# EAGLE design SolarMonitor (EAGLE 6.5.0)
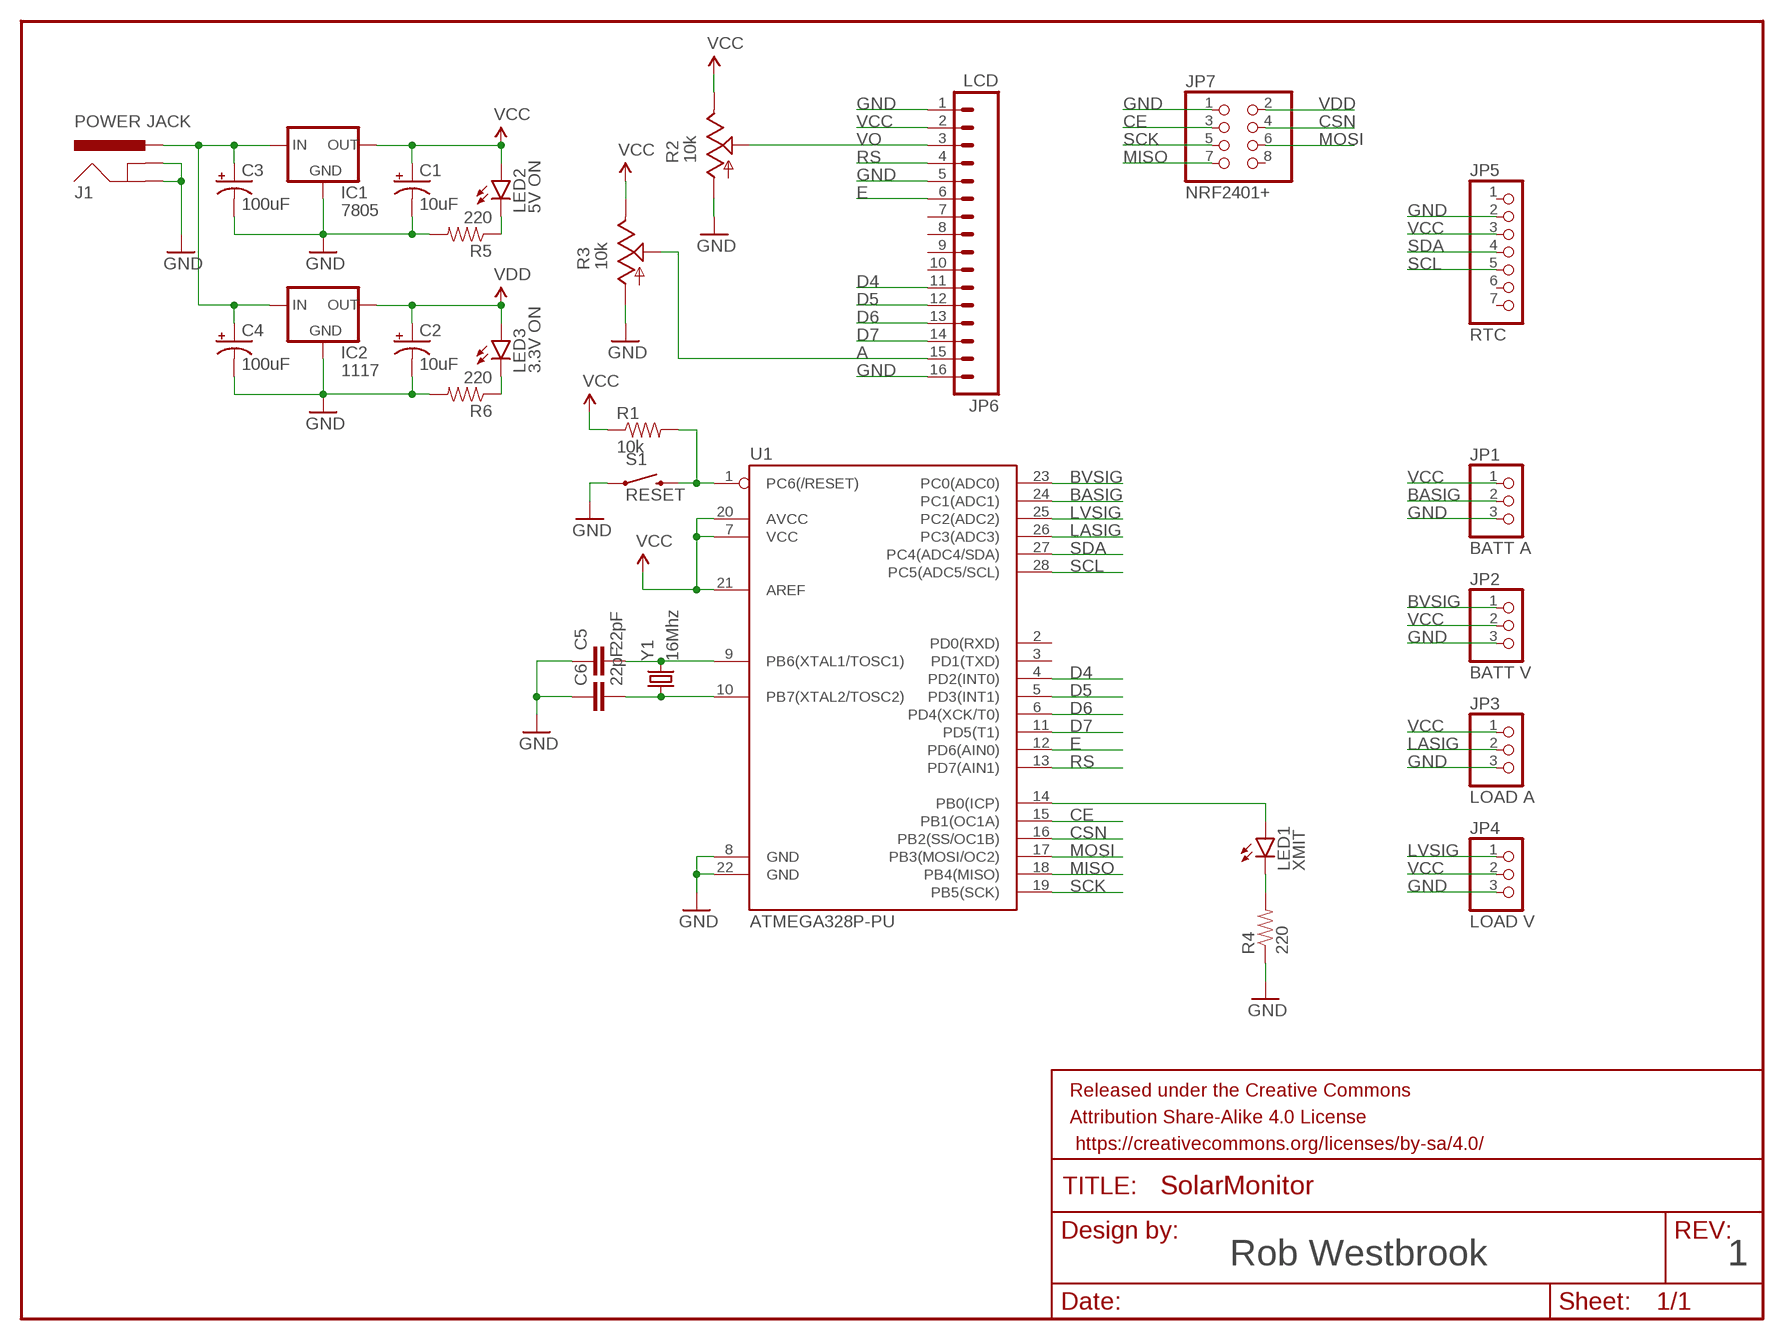
[diagram p0: schematic, sheet 1]

## Parts
C1  10uF  CAP_POLPTH1  [CPOL-RADIAL-100UF-25V]
C2  10uF  CAP_POLPTH1  [CPOL-RADIAL-100UF-25V]
C3  100uF  CAP_POLPTH2  [CPOL-RADIAL-10UF-25V]
C4  100uF  CAP_POLPTH2  [CPOL-RADIAL-10UF-25V]
C5  22pF  CAPEZ  [CAP-PTH-SMALLEZ]
C6  22pF  CAPEZ  [CAP-PTH-SMALLEZ]
FRAME1  FRAME-LETTER  [CREATIVE_COMMONS]
IC1  7805  V_REG_78XX-TO-220  [TO-220-ALT]
IC2  1117  V_REG_LD1117VXX  [78XXL]
J1  POWER JACK  POWER_JACKPTH  [POWER_JACK_PTH]
JP1  BATT A  PINHD-1X3  [1X03]
JP2  BATT V  PINHD-1X3  [1X03]
JP3  LOAD A  PINHD-1X3  [1X03]
JP4  LOAD V  PINHD-1X3  [1X03]
JP5  RTC  PINHD-1X7  [1X07]
JP6  LCD  M16LOCK  [1X16_LOCK]
JP7  NRF2401+  PINHD-2X4  [2X04]
LED1  XMIT  LED5MM  [LED5MM]
LED2  5V ON  LED5MM  [LED5MM]
LED3  3.3V ON  LED5MM  [LED5MM]
R1  10k  RESISTORPTH-1/4W  [AXIAL-0.4]
R2  10k  TRIM_US-S64W  [S64W]
R3  10k  TRIM_US-S64W  [S64W]
R4  220  RESISTORPTH-1/4W  [AXIAL-0.4]
R5  220  RESISTORPTH-1/4W  [AXIAL-0.4]
R6  220  RESISTORPTH-1/4W  [AXIAL-0.4]
S1  RESET  SWITCH-MOMENTARY-2PTH  [TACTILE-PTH]
U1  ATMEGA328P-PU  ATMEGA328P_PDIP  [DIL28-3]
Y1  16Mhz  CRYSTALHC49US  [HC49US]

## Nets
A: JP6.15 R3.S
BASIG: JP1.2 U1.24(PC1(ADC1))
BVSIG: JP2.1 U1.23(PC0(ADC0))
CE: JP7.3 U1.15(PB1(OC1A))
CSN: JP7.4 U1.16(PB2(SS/OC1B))
D4: JP6.11 U1.4(PD2(INT0))
D5: JP6.12 U1.5(PD3(INT1))
D6: JP6.13 U1.6(PD4(XCK/T0))
D7: JP6.14 U1.11(PD5(T1))
E: JP6.6 U1.12(PD6(AIN0))
GND: C1.2(-) C2.2(-) C3.2(-) C4.2(-) C5.1 C6.1 IC1.GND IC2.IN(GND) J1.GND J1.GNDBREAK JP1.3 JP2.3 JP3.3 JP4.3 JP5.2 JP6.1 JP6.5 JP6.16 JP7.1 R2.A R3.A R4.P$1 R5.P$2 R6.P$2 S1.1 U1.8(GND) U1.22(GND)
LASIG: JP3.2 U1.26(PC3(ADC3))
LVSIG: JP4.1 U1.25(PC2(ADC2))
MISO: JP7.7 U1.18(PB4(MISO))
MOSI: JP7.6 U1.17(PB3(MOSI/OC2))
N$1: C3.1(+) C4.1(+) IC1.IN IC2.OUT(IN) J1.PWR
N$2: C5.2 U1.9(PB6(XTAL1/TOSC1)) Y1.2
N$3: C6.2 U1.10(PB7(XTAL2/TOSC2)) Y1.1
N$4: LED1.A U1.14(PB0(ICP))
N$5: LED1.K(C) R4.P$2
N$6: R1.P$2 S1.3 U1.1(PC6(/RESET))
N$7: LED3.K(C) R6.P$1
N$8: LED2.K(C) R5.P$1
RS: JP6.4 U1.13(PD7(AIN1))
SCK: JP7.5 U1.19(PB5(SCK))
SCL: JP5.5 U1.28(PC5(ADC5/SCL))
SDA: JP5.4 U1.27(PC4(ADC4/SDA))
VCC: C1.1(+) IC1.OUT JP1.1 JP2.2 JP3.1 JP4.2 JP5.3 JP6.2 LED2.A R1.P$1 R2.E R3.E U1.7(VCC) U1.20(AVCC) U1.21(AREF)
VDD: C2.1(+) IC2.GND(OUT) JP7.2 LED3.A
VO: JP6.3 R2.S
Unconnected: JP5.1 JP5.6 JP5.7 JP6.7 JP6.8 JP6.9 JP6.10 JP7.8 U1.2(PD0(RXD)) U1.3(PD1(TXD))

## Notes on the sheet
- Rob Westbrook | 1

## Library data of the parts
C1-C4 = SparkFun-Capacitors:CAP_POL: Capacitor Polarized These are standard SMD and PTH capacitors. Normally 10uF, 47uF, and 100uF in electrolytic and tantalum varieties. Always verify the external diameter of the through hole cap, it varies with capacity, voltage, and manufacturer. The EIA devices should be standard.
C5 C6 = SparkFun-Capacitors:CAP: Capacitor Standard 0603 ceramic capacitor, and 0.1" leaded capacitor.
FRAME1 = SparkFun-Aesthetics:FRAME-LETTER: Schematic Frame Standard 8.5x11 US Letter frame
IC1 = SparkFun-PowerIC:V_REG_78XX: Voltage Regulator Standard 7805 5V regulator. IGO (Input Ground Output). Spark Fun Electronics SKU : COM-00107
IC2 = SparkFun-PowerIC:V_REG_LD1117VXX: LD1117VXX voltage regulator. We carry the 3.3V version (COM-00526) in TO-220 package.
J1 = SparkFun-Connectors:POWER_JACK: Power Jack This is the standard 5.5mm barrel jack for power. The PTH is the most common, proven, reliable, footprint. The Slot footprint only works if the mill layer is transmitted to the PCB fab house so be warned. Mating wall wart : TOL-00298 (and others); PROD_ID: PRT-00119
JP1-JP4 = pinhead:PINHD-1X3: PIN HEADER
JP5 = pinhead:PINHD-1X7: PIN HEADER
JP6 = SparkFun-Connectors:M16: 1x16 .1" header
JP7 = pinhead:PINHD-2X4: PIN HEADER
LED1-LED3 = SparkFun-LED:LED: LEDs Standard schematic elements and footprints for 5mm, 3mm, 1206, and 0603 sized LEDs. 5mm - Spark Fun Electronics SKU : COM-00529 (and others)
R1 R4-R6 = SparkFun-Passives:RESISTOR: Resistor Basic schematic elements and footprints for 0603, 1206, and PTH resistors.
R2 R3 = pot:TRIM_US-: POTENTIOMETER
S1 = SparkFun-Electromechanical:SWITCH-MOMENTARY-2: Various NO switches- pushbuttons, reed, etc
U1 = SparkFun-DigitalIC:ATMEGA328P_PDIP: uC used in the Arduino 32kb flash, 1k EEPROM, 2k SRAM This is the through-hole version of this chip.
Y1 = SparkFun-FreqCtrl:CRYSTAL: Various standard crystals. Proven footprints. Spark Fun Electronics SKU : COM-00534

## Net classes
0 default: clearance 0.205 mm

## Board
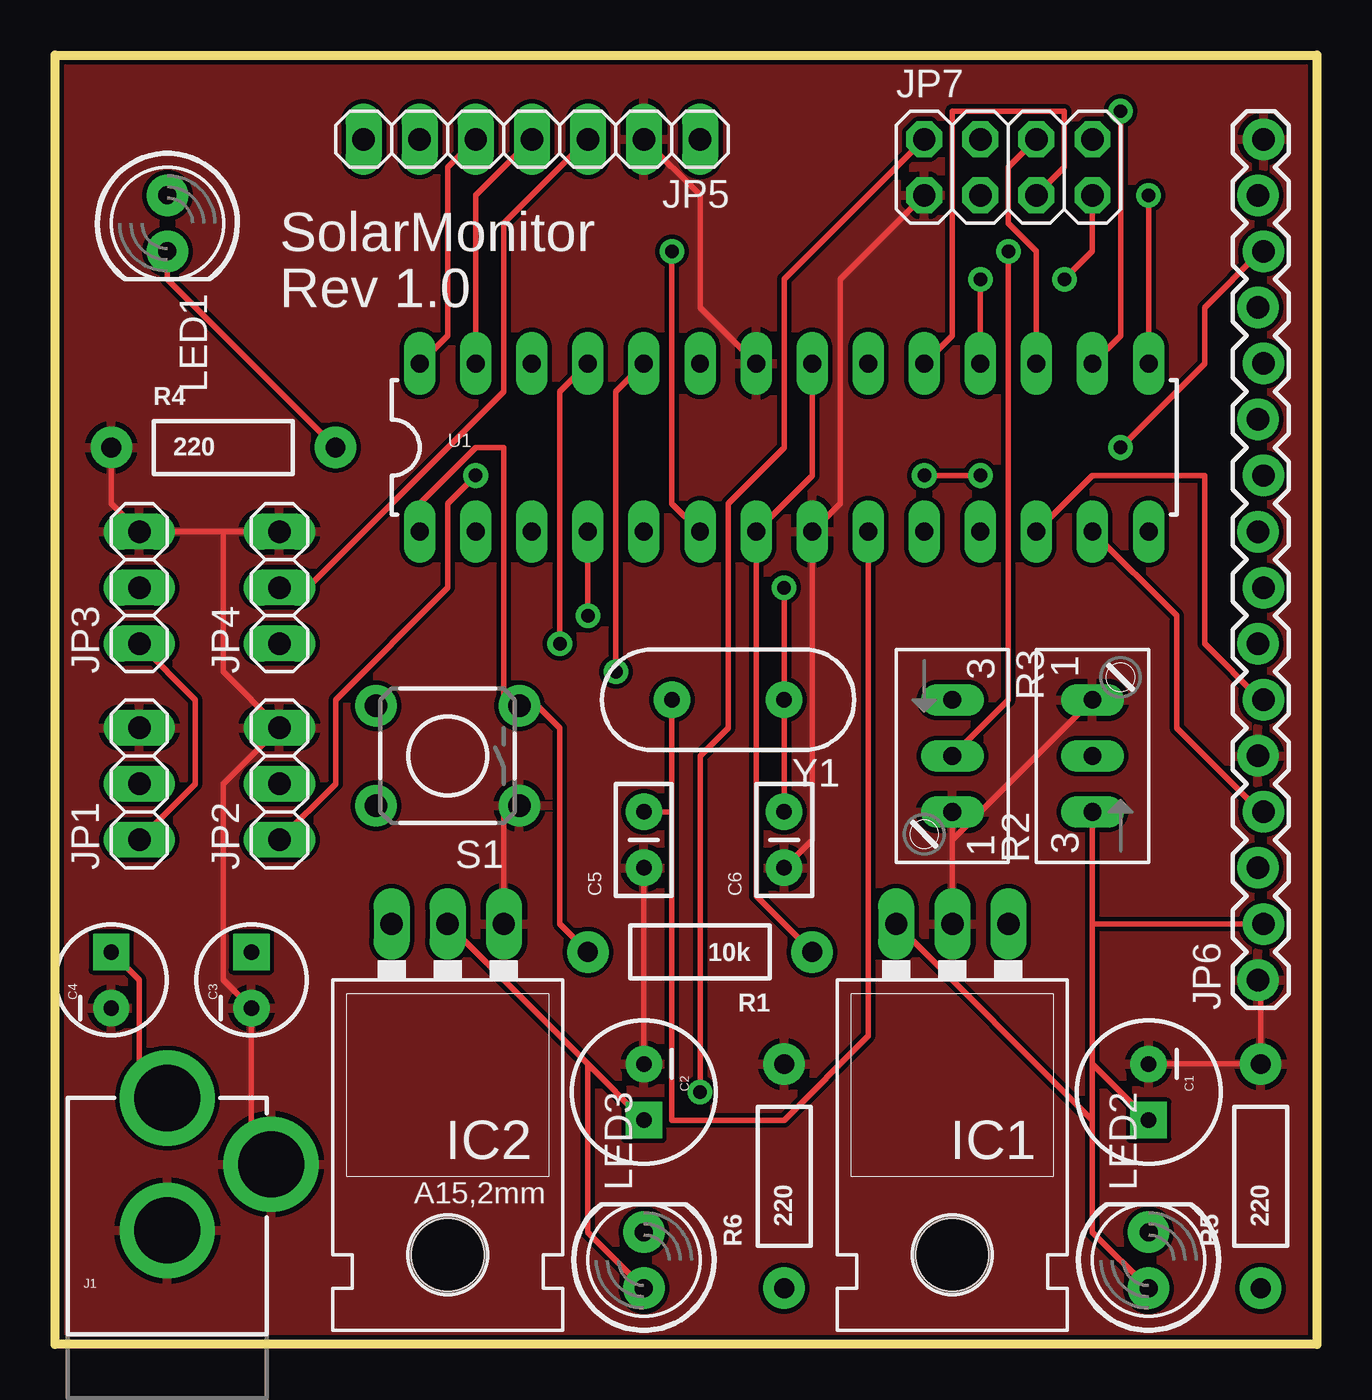
[diagram p1: board, top side]
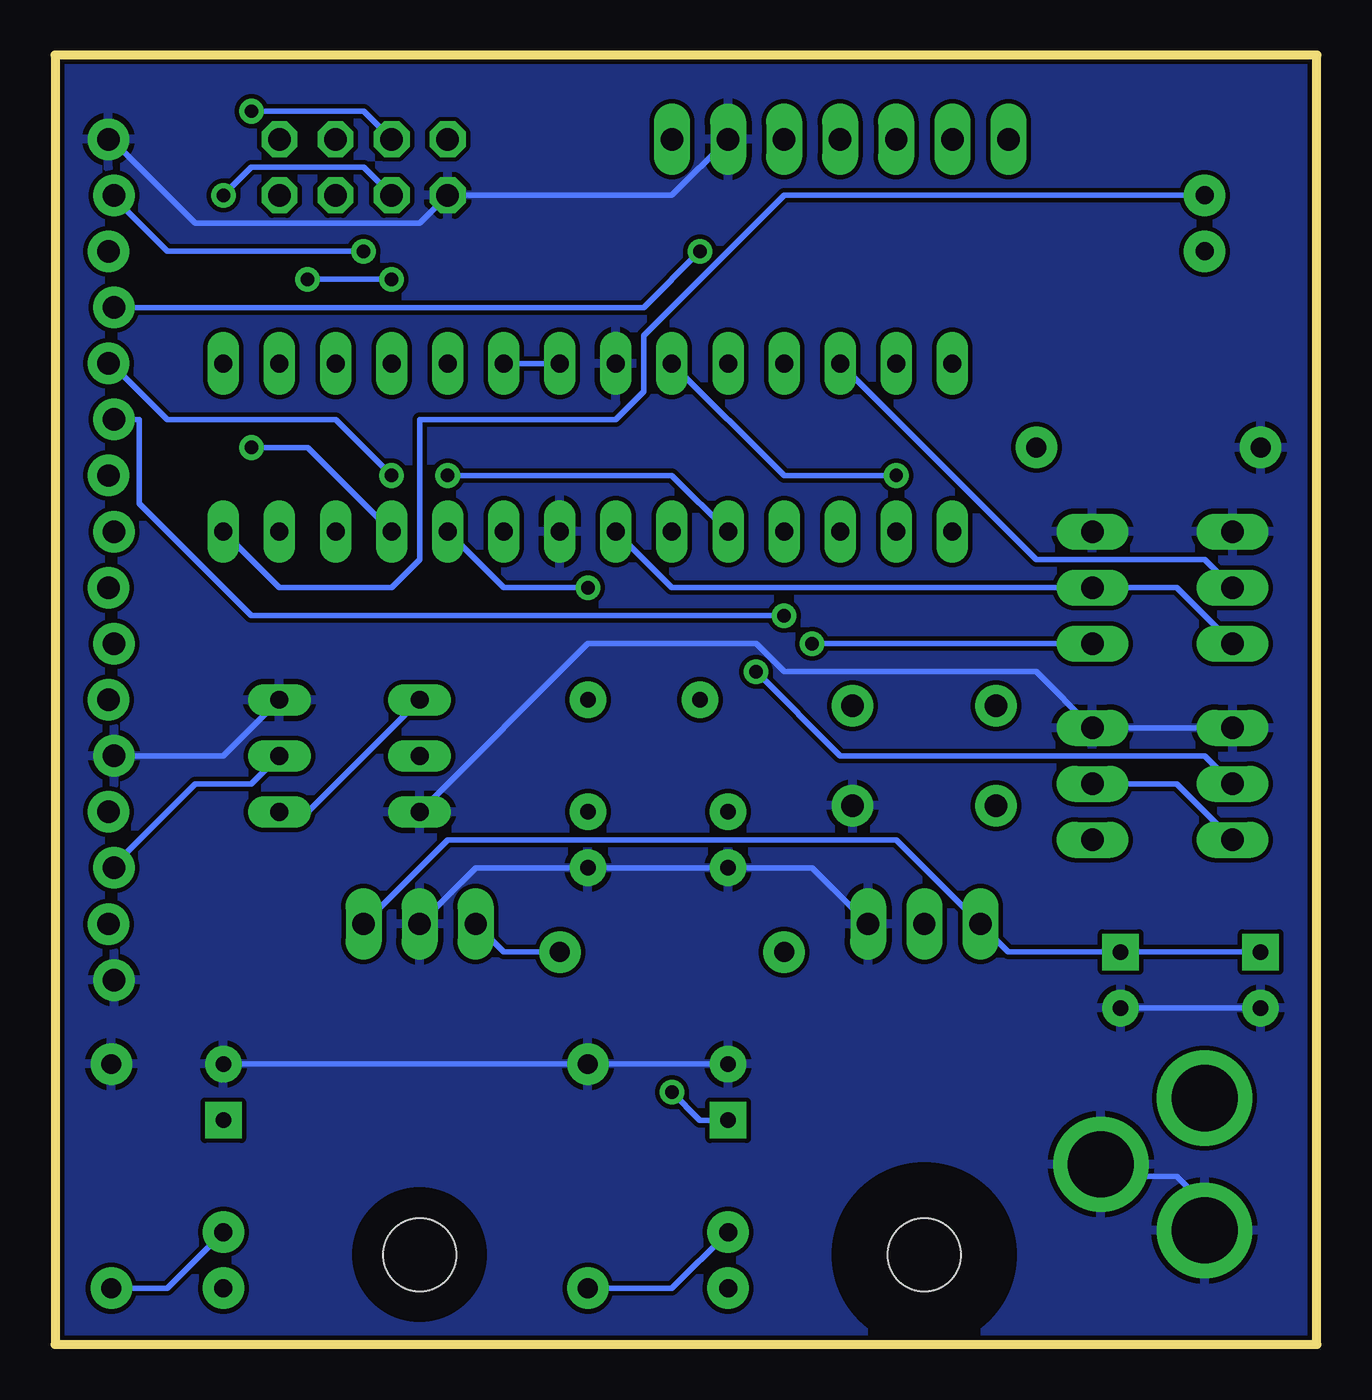
[diagram p2: board, bottom side, seen from below]

Size 57.15 x 58.42 mm. Coordinates in mm from the lower left corner, seen from the top.
Outline: 0,0 0,58.42 57.15,58.42 57.15,0 0,0
Copper layers (1*16): Top 0.035mm / dielectric 1.5mm / Bottom 0.035mm
Design rules "SparkFun": minimum track width 8mil, minimum drill 20mil, track to track 8mil, track to pad 8mil, pad to pad 8mil, via to via 8mil, smd to smd 8mil, copper to edge 8mil, drill to drill 8mil, minimum pad ring 12mil, minimum via ring 10mil, stop-mask expansion 4mil, vias tented up to drill 20mil, thermal gap 10mil

### Footprints (pad centres in the part's own frame; a part is rotated, then mirrored left to right if it is on the bottom)
CPOL-RADIAL-100UF-25V = drill 0.7 pad 1.651 square: 1 1.27,0 | drill 0.7 pad 1.651: 2 -1.27,0
CPOL-RADIAL-10UF-25V = drill 0.7 pad 1.651 square: 1 1.27,0 | drill 0.7 pad 1.651: 2 -1.27,0
CAP-PTH-SMALLEZ = drill 0.7 pad 1.651: 1 0,0; 2 2.54,0
TO-220-ALT = drill 1.016 long: GND 0,-3.81; IN -2.54,-3.81; OUT 2.54,-3.81 | hole 3.302: 0,11.176
78XXL = drill 1.016 long: GND 0,-3.81; IN -2.54,-3.81; OUT 2.54,-3.81 | hole 3.302: 0,11.176
POWER_JACK_PTH = drill 2.997 pad 4.318: GND 0,7.7; GNDBREAK 4.7,10.7; PWR 0,13.7
1X03 = drill 1.016 long: 1 -2.54,0; 2 0,0; 3 2.54,0
1X07 = drill 1.016 long: 1 -7.62,0; 2 -5.08,0; 3 -2.54,0; 4 0,0; 5 2.54,0; 6 5.08,0; 7 7.62,0
1X16_LOCK = drill 1.016 pad 1.88: 1 0,0.127; 2 2.54,-0.127; 3 5.08,0.127; 4 7.62,-0.127; 5 10.16,0.127; 6 12.7,-0.127; 7 15.24,0.127; 8 17.78,-0.127; 9 20.32,0.127; 10 22.86,-0.127; 11 25.4,0.127; 12 27.94,-0.127; 13 30.48,0.127; 14 33.02,-0.127; 15 35.56,0.127; 16 38.1,-0.127
2X04 = drill 1.016 octagon: 1 -3.81,-1.27; 2 -3.81,1.27; 3 -1.27,-1.27; 4 -1.27,1.27; 5 1.27,-1.27; 6 1.27,1.27; 7 3.81,-1.27; 8 3.81,1.27
LED5MM = drill 0.813 pad 1.88: A -1.27,0; K 1.27,0
AXIAL-0.4 = drill 0.9 pad 1.88: P$1 -5.08,0; P$2 5.08,0
S64W = drill 0.813 long: A 2.54,1.27; E -2.54,1.27; S 0,1.27
TACTILE-PTH = drill 1.016 pad 1.88: 1 -3.251,2.261; 2 3.251,2.261; 3 -3.251,-2.261; 4 3.251,-2.261
DIL28-3 = drill 0.813 long: 1 -16.51,-3.81; 2 -13.97,-3.81; 3 -11.43,-3.81; 4 -8.89,-3.81; 5 -6.35,-3.81; 6 -3.81,-3.81; 7 -1.27,-3.81; 8 1.27,-3.81; 9 3.81,-3.81; 10 6.35,-3.81; 11 8.89,-3.81; 12 11.43,-3.81; 13 13.97,-3.81; 14 16.51,-3.81; 15 16.51,3.81; 16 13.97,3.81; 17 11.43,3.81; 18 8.89,3.81; 19 6.35,3.81; 20 3.81,3.81; 21 1.27,3.81; 22 -1.27,3.81; 23 -3.81,3.81; 24 -6.35,3.81; 25 -8.89,3.81; 26 -11.43,3.81; 27 -13.97,3.81; 28 -16.51,3.81
HC49US = drill 0.7 pad 1.651: 1 -2.54,0; 2 2.54,0

### Placement (x,y rotation side)
C1  49.53,11.43 270 top
C2  26.67,11.43 270 top
C3  8.89,16.51 90 top
C4  2.54,16.51 90 top
C5  26.67,21.59 90 top
C6  33.02,21.59 90 top
FRAME1  21.59,-11.43 0 top  (outside the outline)
IC1  40.64,15.24 180 top
IC2  17.78,15.24 180 top
J1  5.08,-2.54 0 top
JP1  3.81,25.4 90 top
JP2  10.16,25.4 90 top
JP3  3.81,34.29 90 top
JP4  10.16,34.29 90 top
JP5  21.59,54.61 180 top
JP6  54.61,16.51 90 top
JP7  43.18,53.34 0 top
LED1  5.08,50.8 270 top
LED2  49.53,3.81 90 top
LED3  26.67,3.81 90 top
R1  29.21,17.78 180 top
R2  48.26,26.67 90 top
R3  39.37,26.67 270 top
R4  7.62,40.64 0 top
R5  54.61,7.62 90 top
R6  33.02,7.62 90 top
S1  17.78,26.67 180 top
U1  33.02,40.64 0 top
Y1  30.48,29.21 180 top

### Tracks (layer width: path | path; a pad name or v marks a point on that pad's centre or on a via)
A  (via drill 0.61)
  Top 0.254: R3.S 43.18,29.21 v43.18,49.53
  Bottom 0.254: v43.18,49.53 52.07,49.53 54.61,52.07 JP6.15
BASIG  (via drill 0.61)
  Top 0.254: U1.24 25.4,43.18 v25.4,30.48
  Bottom 0.254: v25.4,30.48 21.59,26.67 5.08,26.67 JP1.2
BVSIG  (via drill 0.61)
  Top 0.254: v19.05,39.37 17.78,38.1 17.78,34.29 12.7,29.21 12.7,25.4 JP2.1
  Bottom 0.254: U1.23 24.13,39.37 v19.05,39.37
CE  (via drill 0.61)
  Top 0.254: v49.53,52.07 U1.15
  Bottom 0.254: v49.53,52.07 48.26,53.34 43.18,53.34 JP7.3
CSN  (via drill 0.61)
  Top 0.254: U1.16 48.26,45.72 v48.26,55.88
  Bottom 0.254: v48.26,55.88 43.18,55.88 JP7.4
D4  (via drill 0.61)
  Top 0.254: v24.13,33.02 U1.4
  Bottom 0.254: v24.13,33.02 48.26,33.02 53.34,38.1 53.34,41.91 JP6.11 54.61,41.91
D5  (via drill 0.61)
  Top 0.254: v41.91,39.37 v39.37,39.37
  Bottom 0.254: U1.5 29.21,39.37 v39.37,39.37 | v41.91,39.37 44.45,41.91 52.07,41.91 54.61,44.45 JP6.12
D6  (via drill 0.61)
  Top 0.254: U1.6 27.94,38.1 v27.94,49.53
  Bottom 0.254: v27.94,49.53 30.48,46.99 JP6.13 54.61,46.99
D7  (via drill 0.61)
  Top 0.254: v48.26,40.64 52.07,44.45 52.07,46.99 54.61,49.53 JP6.14
  Bottom 0.254: U1.11 45.72,40.64 v48.26,40.64
E
  Top 0.254: U1.12 46.99,39.37 52.07,39.37 52.07,31.75 54.61,29.21 JP6.6
GND
  Top 0.254: R4.P$1 2.54,38.1 JP3.3 7.62,36.83 | 7.62,36.83 JP4.3 | 7.62,36.83 7.62,30.48 JP2.3 7.62,25.4 7.62,16.51 C3.2 8.89,8.89 J1.GNDBREAK | U1.22 29.21,46.99 29.21,52.07 JP5.2 | C1.2 R5.P$2 54.61,16.51 JP6.1 | IC2.IN 20.32,24.13 S1.1 | IC1.GND 40.64,22.86 | 40.64,22.86 R3.A | C6.1 34.29,22.86 U1.8 35.56,38.1 35.56,48.26 JP7.1 | C5.1 C2.2 | 40.64,22.86 R2.A
  Bottom 0.254: JP1.3 JP2.3 12.7,30.48 24.13,30.48 25.4,31.75 33.02,31.75 R3.A | C3.2 C4.2 | J1.GND 5.08,6.35 6.35,7.62 8.89,7.62 J1.GNDBREAK | JP5.2 29.21,52.07 JP7.1 40.64,50.8 50.8,50.8 54.61,54.61 JP6.16 | R2.A 49.53,26.67 JP6.5 54.61,26.67 | C2.2 R6.P$2 C1.2 | IC1.GND 38.1,21.59 C6.1 C5.1 22.86,21.59 IC2.IN
  pour Top: 0,0 0,58.42 57.15,58.42 57.15,0
  pour Bottom: 0,0 0,58.42 57.15,58.42 57.15,0
LASIG
  Bottom 0.254: U1.26 12.7,35.56 5.08,35.56 JP3.2
LVSIG  (via drill 0.61)
  Top 0.254: U1.25 22.86,43.18 v22.86,31.75
  Bottom 0.254: JP4.1 v22.86,31.75
MISO  (via drill 0.61)
  Top 0.254: v41.91,48.26 U1.18 | v45.72,48.26 46.99,49.53 JP7.7
  Bottom 0.254: v45.72,48.26 v41.91,48.26
MOSI
  Top 0.254: U1.17 44.45,49.53 43.18,50.8 43.18,53.34 JP7.6
N$1
  Top 0.254: C4.1 3.81,16.51 3.81,12.7 5.08,11.43 J1.PWR
  Bottom 0.254: IC1.IN 39.37,22.86 19.05,22.86 IC2.OUT 13.97,17.78 C3.1 C4.1
N$2
  Top 0.254: U1.9 36.83,13.97 33.02,10.16 27.94,10.16 27.94,24.13 | Y1.2 27.94,24.13 | 27.94,24.13 C5.2
N$3  (via drill 0.61)
  Top 0.254: v33.02,34.29 Y1.1 C6.2
  Bottom 0.254: U1.10 36.83,34.29 v33.02,34.29
N$4
  Bottom 0.254: U1.14 46.99,34.29 41.91,34.29 40.64,35.56 40.64,41.91 31.75,41.91 30.48,43.18 30.48,45.72 24.13,52.07 LED1.A
N$5
  Top 0.254: R4.P$2 5.08,48.26 LED1.K
N$6
  Top 0.254: U1.1 16.51,38.1 19.05,40.64 20.32,40.64 20.32,29.21 S1.3 21.59,29.21 22.86,27.94 22.86,19.05 R1.P$2
N$7
  Bottom 0.254: LED3.K 29.21,2.54 R6.P$1
N$8
  Bottom 0.254: LED2.K 52.07,2.54 R5.P$1
RS
  Top 0.254: U1.13 50.8,33.02 50.8,27.94 54.61,24.13 JP6.4
SCK
  Top 0.254: U1.19 40.64,45.72 40.64,55.88 45.72,55.88 45.72,53.34 JP7.5
SCL
  Top 0.254: U1.28 17.78,45.72 17.78,53.34 JP5.5
SDA
  Top 0.254: U1.27 19.05,52.07 JP5.4
VCC
  Top 0.254: 46.99,12.7 C1.1 | R2.E 46.99,19.05 | 46.99,19.05 46.99,12.7 | LED2.A 46.99,5.08 46.99,10.16 | 46.99,12.7 46.99,10.16 | 46.99,19.05 JP6.2 | 46.99,10.16 IC1.OUT | U1.21 34.29,39.37 U1.7 31.75,20.32 R1.P$1 | JP5.3 20.32,50.8 20.32,43.18 11.43,34.29 JP4.2 | JP1.1 6.35,25.4 6.35,29.21 JP3.1
  Bottom 0.254: IC1.OUT 36.83,17.78 R1.P$1 | R3.E 45.72,24.13 R2.E | U1.21 U1.20 | JP1.1 6.35,25.4 JP2.2 | JP3.1 6.35,34.29 JP4.2 29.21,34.29 U1.7
VDD  (via drill 0.61)
  Top 0.254: C2.1 24.13,12.7 | 24.13,12.7 IC2.GND | JP7.2 33.02,48.26 33.02,40.64 30.48,38.1 30.48,27.94 29.21,26.67 v29.21,11.43 | LED3.A 24.13,5.08 24.13,12.7
  Bottom 0.254: v29.21,11.43 27.94,10.16 C2.1
VO
  Bottom 0.254: R2.S 48.26,25.4 50.8,25.4 54.61,21.59 JP6.3

### Text on the board
tPlace: SolarMonitor | Rev 1.0